# Altium schematic sheet Time_Base.SchDoc: Title
size 420 x 297 mm; Author: G.Kasprowicz; CompanyName: WUT ISE; DrawnBy: G.Kasprowicz; Organization: WUT ISE; Address1: PW ISE; Address2: Nowowiejska 15/19 00-665 Warsaw; Address3: gkasprow@gmail.com; Revision: 2; SheetNumber: -; SheetTotal: -; ModifiedBy: -; CheckedDate: -; Title2: Title 2; DivGrp: WUT ISE; Designer: G.Kasprowicz; ModifiedDate: -; ProjectName: Sensor Box
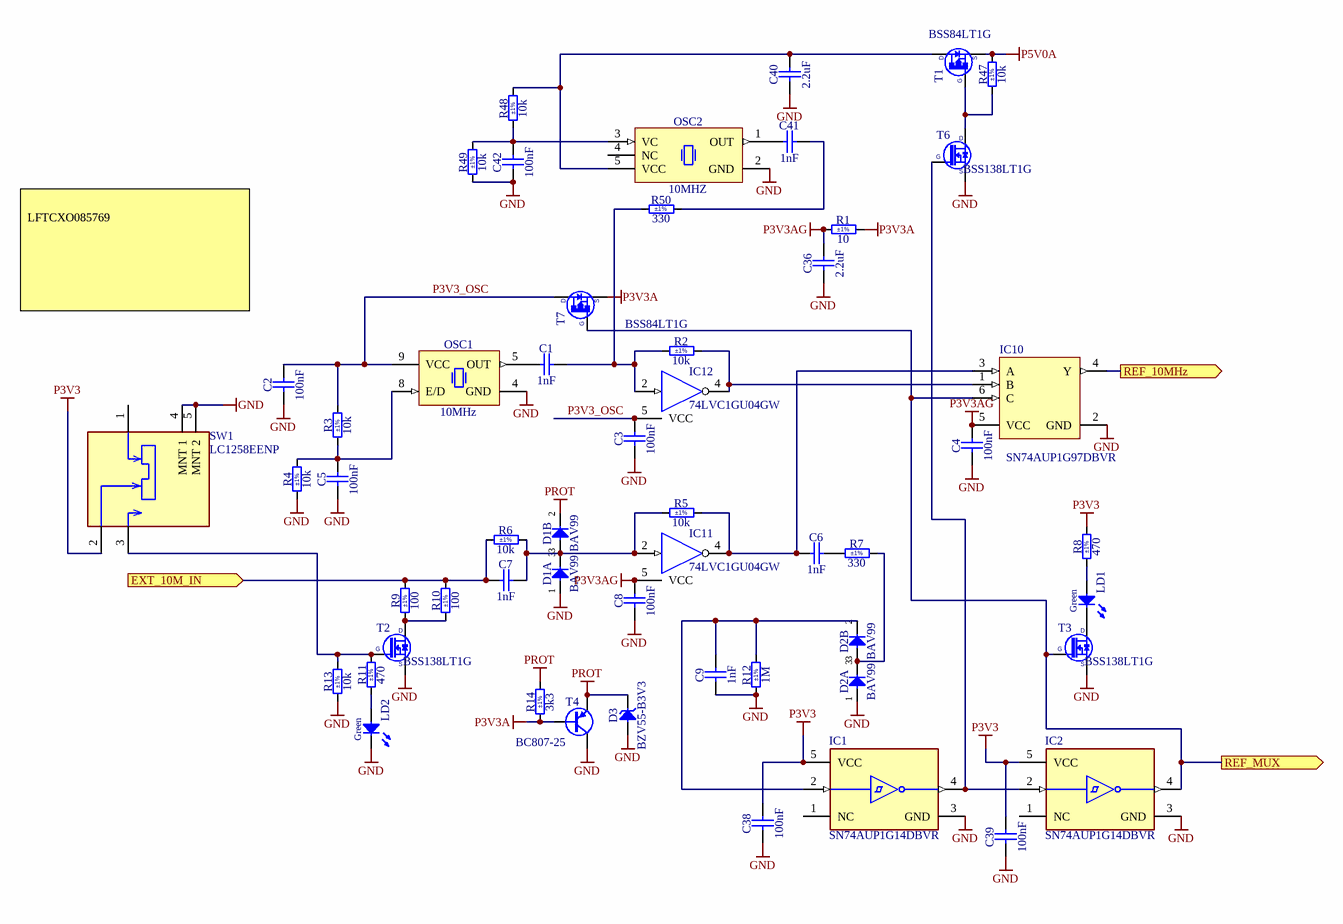
[diagram p0: Time_Base.SchDoc]

## Parts
C1  1nF  [CAPC1608X90N]
C2  100nF  [CAPC1608X90N]
C3  100nF  [CAPC1608X90N]
C4  100nF  [CAPC1608X90N]
C5  100nF  [CAPC1608X90N]
C6  1nF  [CAPC1608X90N]
C7  1nF  [CAPC1608X90N]
C8  100nF  [CAPC1608X90N]
C9  1nF  [CAPC1608X90N]
C36  2.2uF  [CAPC1608X90N]
C38  100nF  [CAPC1608X90N]
C39  100nF  [CAPC1608X90N]
C40  2.2uF  [CAPC1608X90N]
C41  1nF  [CAPC1608X90N]
C42  100nF  [CAPC1608X90N]
D1  BAV99  [SOT95P240X110-3N]  (parts A,B of 2)
D2  BAV99  [SOT95P240X110-3N]  (parts A,B of 2)
D3  BZV55-B3V3  [DIOMELF3515N]
IC1  SN74AUP1G14DBVR  [FP-DBV0005A-IPC_A]
IC2  SN74AUP1G14DBVR  [FP-DBV0005A-IPC_A]
IC10  SN74AUP1G97DBVR  [DBV0006A_L]
IC11  74LVC1GU04GW  [SOT65P212X110-5N]
IC12  74LVC1GU04GW  [SOT65P212X110-5N]
LD1  Green  [LED_AVAGO_HSME-C110]
LD2  Green  [LED_AVAGO_HSME-C110]
OSC1  10MHz  [OSC_CONNOR-WINFIELD_D75]
OSC2  10MHZ  [OSC_CONNOR-WINFIELD_OH100]
R1  10  Tolerance: ±1%  [RESC1608X55N]
R2  10k  Tolerance: ±1%  [RESC1608X55N]
R3  10k  Tolerance: ±1%  [RESC1608X55N]
R4  10k  Tolerance: ±1%  [RESC1608X55N]
R5  10k  Tolerance: ±1%  [RESC1608X55N]
R6  10k  Tolerance: ±1%  [RESC1608X55N]
R7  330  Tolerance: ±1%  [RESC1608X55N]
R8  470  Tolerance: ±1%  [RESC1608X55N]
R9  100  Tolerance: ±1%  [RESC1608X55N]
R10  100  Tolerance: ±1%  [RESC1608X55N]
R11  470  Tolerance: ±1%  [RESC1608X55N]
R12  1M  Tolerance: ±1%  [RESC1608X55N]
R13  10k  Tolerance: ±1%  [RESC1608X55N]
R14  3k3  Tolerance: ±1%  [RESC1608X55N]
R47  10k  Tolerance: ±1%  [RESC1608X55N]
R48  10k  Tolerance: ±1%  [RESC1608X55N]
R49  10k  Tolerance: ±1%  [RESC1608X55N]
R50  330  Tolerance: ±1%  [RESC1608X55N]
SW1  LC1258EENP  [FP-LC1258EENP-MFG]
T1  BSS84LT1G  [SOT95P240X110-3N]
T2  BSS138LT1G  [SOT95P240X110-3N]
T3  BSS138LT1G  [SOT95P240X110-3N]
T4  BC807-25  [SOT95P230X110-3N]
T6  BSS138LT1G  [SOT95P240X110-3N]
T7  BSS84LT1G  [SOT95P240X110-3N]

## Ports
EXT_10M_IN (in), REF_10MHz (out), REF_MUX (out)

## Nets
GND: C2.1 C3.1 C4.1 C5.1 C8.1 C9.1 C36.1 C38.1 C39.1 C40.1 C42.1 D1.1(A) D2.1(A) D3.2(A) IC1.3(GND) IC2.3(GND) IC10.2(GND) IC11.3(GND) IC12.3(GND) LD2.1(C) OSC1.4(GND) OSC2.2(GND) R4.1 R12.1 R13.1 R49.1 SW1.4(MNT_1) SW1.5(MNT_2) T2.2(S) T3.2(S) T4.3(C) T6.2(S)
P3V3: C38.2 C39.2 IC1.5(VCC) IC2.5(VCC) R8.2 SW1.2
P3V3A: R1.2 R14.1 T4.1(B) T7.2(S)
P3V3AG: C4.2 C8.2 C36.2 IC10.5(VCC) IC11.5(VCC) R1.1
P5V0A: R47.2 T1.2(S)
PROT: D1.2(C) D3.1(C) R14.2 T4.2(E)
EXT_10M_IN: C7.1 R6.1 R9.2 R10.2 ; port EXT_10M_IN
P3V3_OSC: C2.2 C3.2 IC12.5(VCC) OSC1.9(VCC) R3.2 T7.3(D)
REF_10MHz: IC10.4(Y) ; port REF_10MHz
REF_MUX: IC2.4(Y) IC10.6(C) T3.1(G) T7.1(G) ; port REF_MUX
NetC1_1: C1.1 OSC1.5(OUT)
NetC1_2: C1.2 IC12.2(IN) R2.1 R50.1
NetC5_2: C5.2 OSC1.8(E/D) R3.1 R4.2
NetC6_1: C6.1 IC10.3(A) IC11.4(OUT) R5.2
NetC6_2: C6.2 R7.1
NetC7_2: C7.2 D1.3(COMAC) IC11.2(IN) R5.1 R6.2
NetC9_2: C9.2 D2.2(C) IC1.2(A) R12.2
NetC40_2: C40.2 OSC2.5(VCC) R48.2 T1.3(D)
NetC41_1: C41.1 OSC2.1(OUT)
NetC41_2: C41.2 R50.2
NetC42_2: C42.2 OSC2.3(VC) R48.1 R49.2
NetD2_3: D2.3(COMAC) R7.2
NetIC1_4: IC1.4(Y) IC2.2(A) T6.1(G)
NetIC10_1: IC10.1(B) IC12.4(OUT) R2.2
NetLD1_1: LD1.1(C) T3.3(D)
NetLD1_2: LD1.2(A) R8.1
NetLD2_2: LD2.2(A) R11.1
NetR9_1: R9.1 R10.1 T2.3(D)
NetR11_2: R11.2 R13.2 SW1.3 T2.1(G)
NetR47_1: R47.1 T1.1(G) T6.3(D)

Not connected (* = marked no-connect by the designer): IC1 1(NC); IC2 1(NC); OSC2 4(NC); SW1 1

## Notes on the sheet
- LFTCXO085769
- Project/Equipment
- Document
- Designer
- Drawn by
- Check.by
- Copyright WUT ISE 2024.
  This documentation describes Open Hardware and is licensed under the CERN OHL v.2. You may redistribute and modify this documentation under the terms of the CERN OHL v.2. (http://ohwr.org/CERNOHL). This documentation is distributed WITHOUT ANY EXPRESS OR IMPLIED WARRANTY, INCLUDING OF MERCHANTABILITY, SATISFACTORY QUALITY AND FITNESS FOR A PARTICULAR PURPOSE. Please see the CERN OHL v.2 for applicable conditions.
- Contact
- File
- Last Mod.
- Print Date
- Sheet
- Size
- A3
- of
- Rev

## Library data of the parts
C1 C6 C7 C9 C41 = CC0603_1NF_50V_1%_NP0: Non-polarised capacitor; Part Description: SMD Multilayer Chip Ceramic Capacitor; Manufacturer: GENERIC; Manufacturer1 Part Number: 06035A102FAT2A; Voltage: 50V; TC: C0G/NP0; Tolerance: ±1%; Part Number: CC0603_1NF_50V_1%_NP0; Component Kind: Standard; Component Type: Standard; Pin Count: 2; Value: 1nF; Status: None; Manufacturer Part Number: CC0603_1NF_50V_1%_NP0; Case: 0603; Mounted: Yes; Socket: No; SMD: Yes; Sense: No; Manufacturer1 Example: AVX; Manufacturer1 ComponentHeight: 0.9mm; HelpURL: \\cern.ch\dfs\Applications\Altium\Datasheets\CC0603_C0G_AVX.pdf; Author: CERN DEM JLC; CreateDate: 15.06.2017; LatestRevisionDate: 15.06.2017
C2-C5 C8 C38 C39 C42 = CC0603_100NF_100V_10%_X7R: Non-polarised capacitor; Part Description: SMD Multilayer Chip Ceramic Capacitor; Manufacturer: GENERIC; Manufacturer1 Part Number: GRM188R72A104KA35D; Voltage: 100V; TC: X7R; Tolerance: ±10%; Part Number: CC0603_100NF_100V_10%_X7R; Component Kind: Standard; Component Type: Standard; Pin Count: 2; Value: 100nF; Status: None; Manufacturer Part Number: CC0603_100NF_100V_10%_X7R; Case: 0603; Mounted: Yes; Socket: No; SMD: Yes; Sense: No; Manufacturer1 Example: MURATA; Manufacturer1 ComponentHeight: 0.9mm; HelpURL: \\cern.ch\dfs\Applications\Altium\Datasheets\CC0603_MURATA_GRM188R72A104KA35D.pdf; Author: CERN DEM JLC; CreateDate: 11.12.2013; LatestRevisionDate: 11.12.2013
C36 C40 = CC0603_2.2UF_10V_20%_X7R: Non-polarised capacitor; Part Description: SMD Multilayer Chip Ceramic Capacitor; Manufacturer: GENERIC; Manufacturer1 Part Number: LMK107B7225MA-T; Voltage: 10V; TC: X7R; Tolerance: ±20%; Part Number: CC0603_2.2UF_10V_20%_X7R; Component Kind: Standard; Component Type: Standard; Pin Count: 2; Value: 2.2uF; Status: Not Recommended; Manufacturer Part Number: CC0603_2.2UF_10V_20%_X7R; Case: 0603; Mounted: Yes; Socket: No; SMD: Yes; Sense: No; Manufacturer1 Example: TAIYO YUDEN; Manufacturer1 ComponentHeight: 0.9mm; HelpURL: \\cern.ch\dfs\Applications\Altium\Datasheets\CC0603_X7R_TAIYO-YUDEN_HIGH-VALUE.pdf; Author: CERN DEM JLC; CreateDate: 22.06.2011; LatestRevisionDate: 27.06.2011
D1 D2 = BAV99: Serial Diode; Part Description: Dual Series Signal Diode; Manufacturer: FAIRCHILD SEMICONDUCTOR; Voltage: 70V; Power: 350mW; PressFit: No; Bonding: No; Part Number: BAV99; Component Kind: Standard; Component Type: Standard; Device: BAV99; PackageDescription: SOT, 0.95mm Pitch; 3 Pin, 1.40mm W X 3.00mm L X 1.10mm H body, IPC Medium Density; Manufacturer Part Number: BAV99; Pin Count: 3; Case: SOT23-3; Mounted: Yes; Socket: No; SMD: Yes; Sense: No; ComponentHeight: 1.1mm; HelpURL: \\cern.ch\dfs\Applications\Altium\Datasheets\BAV99.pdf; Author: CERN DEM JLC; CreateDate: 06.05.2008; LatestRevisionDate: 27.09.2012
D3 = BZV55-B3V3: Zener Diode; Part Description: Voltage Regulator Diode; Manufacturer: NEXPERIA; Voltage: 3V3; Power: 500mW; PressFit: No; Bonding: No; Part Number: BZV55-B3V3; Component Kind: Standard; Component Type: Standard; Device: BZV55-B3V3; PackageDescription: SOD80C, MELF Diode, 2-Leads, Body 3.5x1.5mm, IPC Medium Density; Manufacturer Part Number: BZV55-B3V3; Pin Count: 2; Case: SOD-80C; Mounted: Yes; Socket: No; SMD: Yes; Sense: No; ComponentHeight: 1.6mm; HelpURL: \\cern.ch\dfs\Applications\Altium\Datasheets\BZV55.pdf; Author: CERN DEM JLC; CreateDate: 06.05.2008; LatestRevisionDate: 22.01.2018
IC1 IC2 = CMP-0859-00076-5: IC INVERTER SCHMITT 1CH SOT23-5; Max Supply Voltage: 3.6V; Propagation Delay: 20.5ns; Quiescent Current: 500nA; Number of Elements: 1; Logic Function: Buffer; Output Current: 4mA; Turn-On Delay Time: 6.2ns; Min Supply Voltage: 800mV; Input Type: SCHMITT TRIGGER; High Level Output Current: -4mA; Mount: Surface Mount; Number of Gates: 1; Lead Free: Lead Free; Number of Inputs: 1; Number of Bits: 1; Max Operating Temperature: 85°C; Contact Plating: Gold; Case/Package: SOT-23; Weight: 0.000395oz; Technology: CMOS; Low Level Output Current: 4mA; Series: 74AUP; Packaging: Tape and Reel; Number of Circuits: 1; Package Quantity: 3000; Radiation Hardening: No; Number of Pins: 5; RoHS Compliant: Yes; REACH SVHC: No SVHC; Min Operating Temperature: -40°C
IC10 = CMP-0859-00219-3: Low-Power Configurable Multiple-Function Gate, DBV0006A, LARGE T&R; Manufacturer: Texas Instruments; ICC @ Nom Voltage(Max)(mA): 0.0009; Input Type: CMOS; VCC(Max)(V): 3.6; Schmitt Trigger: No; Rating: Catalog; Logic: True; Bits(#): 1; Sub-Family: Configurable Logic; F @ Nom Voltage(Max)(Mhz): 100; VCC(Min)(V): 0.8; Voltage(Nom)(V): 0.8,1.2,1.5,1.8,2.5,3.3; tpd @ Nom Voltage(Max)(ns): 36.7,21.4,14.8,11.8,8.8,7.3; Technology Family: AUP; Output Drive (IOL/IOH)(Max)(mA): 20/-20; Generic Part Number: SN74AUP1G97; Gate Type: Configurable; Output Type: CMOS; 3-State Output: No; Operating Temperature Range(C): -40 to 85; DatasheetVersion: SCES505J; PackageReference: DBV0006A
IC11 IC12 = 74LVC1GU04GW: Single Inverter Buffer; Manufacturer: NXP SEMICONDUCTORS; PressFit: No; Bonding: No; Part Number: 74LVC1GU04GW; Component Kind: Standard; Component Type: Standard; Device: 74LVC1GU04GW; PackageDescription: SOT353, SC70-5, 0.65mm Pitch; 5 Pin, 1.25mm W X 2.05mm L X 1.10mm H body, IPC Medium Density; Part Description: Inverter; Manufacturer Part Number: 74LVC1GU04GW; Pin Count: 3; Case: SOT353; Mounted: Yes; Socket: No; SMD: Yes; Sense: No; ComponentHeight: 1.1mm; Author: CERN DEM JLC; HelpURL: \\cern.ch\dfs\Applications\Altium\Datasheets\74LVC1GU04GW.pdf; CreateDate: 11.01.2011; LatestRevisionDate: 11.01.2011
LD1 LD2 = LED_AVAGO_HSME-C110: LED Green 1C 2A; Part Description: High Performance Right Angle Chip Green LED; Manufacturer: AVAGO TECHNOLOGIES; PressFit: No; Bonding: No; Part Number: LED_AVAGO_HSME-C110; Component Kind: Standard; Component Type: Standard; Color: Green; PackageDescription: Green Chip LED, 2-Leads, Body 3.3x1.6mm, Side Emitting Package; Manufacturer Part Number: HSME-C110; Pin Count: 2; Case: 1206; Mounted: Yes; Socket: No; SMD: Yes; Sense: No; ComponentHeight: 1.1mm; HelpURL: \\cern.ch\dfs\Applications\Altium\Datasheets\LED_AVAGO_HSME-C110.pdf; ComponentLink1URL: \\cern.ch\dfs\Applications\Altium\Datasheets\LED_AVAGO_HSME-C110_DESIGN-GUIDE.pdf; ComponentLink1Description: Design Guide; Author: CERN DEM JMW; CreateDate: 30.07.2009; LatestRevisionDate: 20.06.2012
OSC1 = OSC_10MHZ_CONNOR-WINFIELD_D75A-010.0M: Oscillator 4 pins 4=GND 5=OUT 8=E/D 9=VCC; Part Description: 3.3V, ±0.28ppm, 15pF, 0 to 70°C, LVCMOS, Precision Tri-State Surface Mount TCXO Temperature Compensated Crystal Oscillator, D75A Series; PressFit: No; Bonding: No; Part Number: OSC_10MHZ_CONNOR-WINFIELD_D75A-010.0M; Component Kind: Standard; Component Type: Standard; PackageDescription: SMD TCXO, Side Concave, 10 Pins, 5.00x7.00mm, D75 Series; Value: 10MHz; Manufacturer: CONNOR-WINFIELD; Manufacturer Part Number: D75A-010.0M; Pin Count: 4; Mounted: Yes; Socket: No; SMD: Yes; Sense: No; ComponentHeight: 2mm; HelpURL: \\cern.ch\dfs\Applications\Altium\Datasheets\OSC_CONNOR-WINFIELD_D75A.pdf; Author: CERN DEM JLC; CreateDate: 22.11.2011; LatestRevisionDate: 22.11.2011
OSC2 = OSC_10MHZ_CONNOR-WINFIELD_OH100-71003SV: STRATUM 3E High Stability Oven Stabilized Oscillator, VCOCXO (OH100 Series); Part Description: Sinewave 5V, ±5.0ppb, 0°C ..+70°C, STRATUM 3E High Stability Oven Stabilized Oscillator,  VCOCXO / (OH100 Series); Manufacturer Part Number: OH100-71003SV-010.0M; PressFit: No; Bonding: No; Part Number: OSC_10MHZ_CONNOR-WINFIELD_OH100-71003SV; Component Kind: Standard; Component Type: Standard; PackageDescription: 5 Pins, 25.4mm x 25.4mm, THD Oven Stabilized Oscillator OH100 Series; Value: 10MHZ; Manufacturer: CONNOR-WINFIELD; Pin Count: 5; Mounted: Yes; Socket: No; SMD: No; Sense: No; ComponentHeight: 12.7mm; HelpURL: \\cern.ch\dfs\Applications\Altium\Datasheets\OSC_CONNOR-WINFIELD_OH100.pdf; Author: CERN DEM BC; CreateDate: 15.02.2021; LatestRevisionDate: 15.02.2021
R1 = R0603_10R_1%_0.1W_100PPM: Resistor - 1%; Part Description: General Purpose Thick Film Chip Resistor; Manufacturer: GENERIC; Manufacturer1 Part Number: RMCF0603FT10R0; Power: 0.1W; TC: ±100ppm/°C; PressFit: No; Part Number: R0603_10R_1%_0.1W_100PPM; Component Kind: Standard; Component Type: Standard; Pin Count: 2; Value: 10; Status: Preferred; Manufacturer Part Number: R0603_10R_1%_0.1W_100PPM; Case: 0603; Mounted: Yes; Sense: No; Socket: No; SMD: Yes; Manufacturer1 Example: STACKPOLE ELECTRONICS; Manufacturer1 ComponentHeight: 0.6mm; HelpURL: \\cern.ch\dfs\Applications\Altium\Datasheets\R0603_STACKPOLE_RMCF.pdf; Author: CERN DEM HF; CreateDate: 06.02.2024; LatestRevisionDate: 06.02.2024
R2-R6 R13 R47-R49 = R0603_10K_1%_0.1W_100PPM: Resistor - 1%; Part Description: General Purpose Thick Film Chip Resistor; Manufacturer: GENERIC; Manufacturer1 Part Number: NRC06F1002TRF; Power: 0.1W; TC: ±100ppm/°C; PressFit: No; Part Number: R0603_10K_1%_0.1W_100PPM; Component Kind: Standard; Component Type: Standard; Pin Count: 2; Value: 10k; Status: Preferred; Manufacturer Part Number: R0603_10K_1%_0.1W_100PPM; Case: 0603; Mounted: Yes; Sense: No; Socket: No; SMD: Yes; Manufacturer1 Example: NIC COMPONENT; Manufacturer1 ComponentHeight: 0.55mm; HelpURL: \\cern.ch\dfs\Applications\Altium\Datasheets\R0603_NIC_NRC.pdf; Author: CERN DEM JLC; CreateDate: 03.12.2007; LatestRevisionDate: 13.03.2008
R7 R50 = R0603_330R_1%_0.1W_100PPM: Resistor - 1%; Part Description: General Purpose Thick Film Chip Resistor; Manufacturer: GENERIC; Manufacturer1 Part Number: NRC06F3300TRF; Power: 0.1W; TC: ±100ppm/°C; PressFit: No; Part Number: R0603_330R_1%_0.1W_100PPM; Component Kind: Standard; Component Type: Standard; Pin Count: 2; Value: 330; Status: Preferred; Manufacturer Part Number: R0603_330R_1%_0.1W_100PPM; Case: 0603; Mounted: Yes; Sense: No; Socket: No; SMD: Yes; Manufacturer1 Example: NIC COMPONENT; Manufacturer1 ComponentHeight: 0.55mm; HelpURL: \\cern.ch\dfs\Applications\Altium\Datasheets\R0603_NIC_NRC.pdf; Author: CERN DEM JLC; CreateDate: 03.12.2007; LatestRevisionDate: 13.03.2008
R8 R11 = R0603_470R_1%_0.1W_100PPM: Resistor - 1%; Part Description: General Purpose Thick Film Chip Resistor; Manufacturer: GENERIC; Manufacturer1 Part Number: NRC06F4700TRF; Power: 0.1W; TC: ±100ppm/°C; PressFit: No; Part Number: R0603_470R_1%_0.1W_100PPM; Component Kind: Standard; Component Type: Standard; Pin Count: 2; Value: 470; Status: Preferred; Manufacturer Part Number: R0603_470R_1%_0.1W_100PPM; Case: 0603; Mounted: Yes; Sense: No; Socket: No; SMD: Yes; Manufacturer1 Example: NIC COMPONENT; Manufacturer1 ComponentHeight: 0.55mm; HelpURL: \\cern.ch\dfs\Applications\Altium\Datasheets\R0603_NIC_NRC.pdf; Author: CERN DEM JLC; CreateDate: 03.12.2007; LatestRevisionDate: 13.03.2008
R9 R10 = R0603_100R_1%_0.1W_100PPM: Resistor - 1%; Part Description: General Purpose Thick Film Chip Resistor; Manufacturer: GENERIC; Manufacturer1 Part Number: NRC06F4700TRF; Power: 0.1W; TC: ±100ppm/°C; PressFit: No; Part Number: R0603_100R_1%_0.1W_100PPM; Component Kind: Standard; Component Type: Standard; Pin Count: 2; Value: 100; Status: Preferred; Manufacturer Part Number: R0603_100R_1%_0.1W_100PPM; Case: 0603; Mounted: Yes; Sense: No; Socket: No; SMD: Yes; Manufacturer1 Example: NIC COMPONENT; Manufacturer1 ComponentHeight: 0.55mm; HelpURL: \\cern.ch\dfs\Applications\Altium\Datasheets\R0603_NIC_NRC.pdf; Author: CERN DEM JLC; CreateDate: 03.12.2007; LatestRevisionDate: 13.03.2008
R12 = R0603_1M_1%_0.1W_100PPM: Resistor - 1%; Part Description: General Purpose Thick Film Chip Resistor; Manufacturer: GENERIC; Manufacturer1 Part Number: NRC06F1004TRF; Power: 0.1W; TC: ±100ppm/°C; PressFit: No; Part Number: R0603_1M_1%_0.1W_100PPM; Component Kind: Standard; Component Type: Standard; Pin Count: 2; Value: 1M; Status: Preferred; Manufacturer Part Number: R0603_1M_1%_0.1W_100PPM; Case: 0603; Mounted: Yes; Sense: No; Socket: No; SMD: Yes; Manufacturer1 Example: NIC COMPONENT; Manufacturer1 ComponentHeight: 0.55mm; HelpURL: \\cern.ch\dfs\Applications\Altium\Datasheets\R0603_NIC_NRC.pdf; Author: CERN DEM JLC; CreateDate: 03.12.2007; LatestRevisionDate: 13.03.2008
R14 = R0603_3K3_1%_0.1W_100PPM: Resistor - 1%; Part Description: General Purpose Thick Film Chip Resistor; Manufacturer: GENERIC; Manufacturer1 Part Number: NRC06F3301TRF; Power: 0.1W; TC: ±100ppm/°C; PressFit: No; Part Number: R0603_3K3_1%_0.1W_100PPM; Component Kind: Standard; Component Type: Standard; Pin Count: 2; Value: 3k3; Status: Preferred; Manufacturer Part Number: R0603_3K3_1%_0.1W_100PPM; Case: 0603; Mounted: Yes; Sense: No; Socket: No; SMD: Yes; Manufacturer1 Example: NIC COMPONENT; Manufacturer1 ComponentHeight: 0.55mm; HelpURL: \\cern.ch\dfs\Applications\Altium\Datasheets\R0603_NIC_NRC.pdf; Author: CERN DEM JLC; CreateDate: 03.12.2007; LatestRevisionDate: 13.03.2008
SW1 = CMP-17874-000001-1: SWITCH PUSHBUTTON SPDT 0.3A 30V; Manufacturer: E-Switch; Contact Resistance: 20mΩ; Contact Current Rating: 300mA; Operating Force: 230gf; Electromechanical Life: 10000Cycles; Temperature Range Low: -20°C; Mouser Description: Pushbutton Switch, Right Angle, Dpdt, On-(On), Pc Tail Terminal, Pcb Hole Count: 5; Category: Switch; Device Class L2: Switches; RoHS: TRUE; ComponentLink2URL: https://www.e-switch.com/system/asset/product_line/data_sheet/36/LC.pdf; Device Class L3: Pushbutton Switches; Package: LC1258EENP; Automotive: No; Height: 8.55mm; Temperature Range High: +85°C; Octopart: https://octopart.com/lc1258eenp-e-switch-1061525; Mount: Through Hole; Digikey Description: SWITCH PUSHBUTTON SPDT 0.3A 30V; Lead Free: Yes; Footprint Url: http://spec_sheets.e-switch.com/specs/P070130.pdf; Voltage Rating Dc: 30V; Manufacturer Part Number: LC1258EENP; Temperature: -20°C to +85°C; Device Class L1: Electromechanical; Throw Configuration: SPDT; ComponentLink2Description: Datasheet
T1 T7 = BSS84LT1G: P-CHANNEL MOSFET WITH DIODE; Part Description: 50V, 130mA, Single P-Channel Power MOSFET; Manufacturer: ON SEMICONDUCTOR; Manufacturer Part Number: BSS84L; PressFit: No; Bonding: No; Part Number: BSS84LT1G; Component Kind: Standard; Component Type: Standard; Device: BSS84LT1G; PackageDescription: SOT23, 0.95mm Pitch; 3 Pin, 1.40mm W X 3.00mm L X 1.10mm H body, IPC Medium Density; Pin Count: 3; Case: SOT23-3; Mounted: Yes; Socket: No; SMD: Yes; Sense: No; ComponentHeight: 1.1mm; HelpURL: \\cern.ch\dfs\Applications\Altium\Datasheets\BSS84LT1G.pdf; Author: CERN DEM JLC; CreateDate: 29.03.2012; LatestRevisionDate: 25.05.2022
T2 T3 T6 = BSS138LT1G: N-CHANNEL MOSFET WITH DIODE; Part Description: 50V, 200mA N-Channel Enhancement Mode Field-Effect Transistor; Manufacturer: ON SEMICONDUCTOR; PressFit: No; Bonding: No; Part Number: BSS138LT1G; Component Kind: Standard; Component Type: Standard; Device: BSS138LT1G; PackageDescription: SOT23, 0.95mm Pitch; 3 Pin, 1.40mm W X 3.00mm L X 1.10mm H body, IPC Medium Density; Manufacturer Part Number: BSS138L; Pin Count: 3; Case: SOT23-3; Mounted: Yes; Socket: No; SMD: Yes; Sense: No; ComponentHeight: 1.11mm; HelpURL: \\cern.ch\dfs\Applications\Altium\Datasheets\BSS138LT1G.pdf; Author: CERN DEM JLC; CreateDate: 23.03.2009; LatestRevisionDate: 25.05.2022
T4 = BC807-25: PNP Transistor; Part Description: -45V, -500mA PNP General-Purpose Transistor; Manufacturer: NXP SEMICONDUCTORS; PressFit: No; Bonding: No; Part Number: BC807-25; Component Kind: Standard; Component Type: Standard; Device: BC807-25; PackageDescription: SOT23, 0.95mm Pitch; 3 Pin, 1.30mm W X 2.90mm L X 1.10mm H body, IPC Medium Density; Manufacturer Part Number: BC807-25; Pin Count: 3; Case: SOT23-3; Mounted: Yes; Socket: No; SMD: Yes; Sense: No; ComponentHeight: 1.1mm; HelpURL: \\cern.ch\dfs\Applications\Altium\Datasheets\BC807-25.pdf; Author: CERN DEM JLC; CreateDate: 12.09.2012; LatestRevisionDate: 12.09.2012